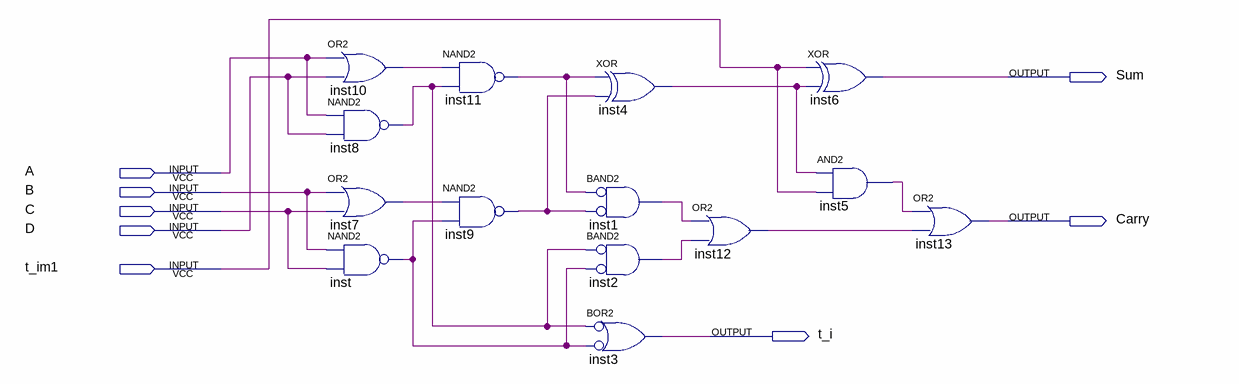
[diagram p0: schematic sheet]
// Quartus schematic 4to2_comp.bdf as structural Verilog: 14 symbols, 8 pins
module \4to2_comp  (
  input  A,
  input  B,
  input  C,
  input  D,
  input  t_im1,
  output Sum,
  output Carry,
  output t_i
);

  wire inst1_out, inst2_out, inst4_out, inst5_out, inst7_out, inst8_out, inst9_out, inst10_out, inst11_out,
       inst12_out, inst_out;

  or inst10 (inst10_out, A, D);
  nand inst8 (inst8_out, A, D);
  or inst7 (inst7_out, B, C);
  nand inst (inst_out, B, C);
  nand inst11 (inst11_out, inst10_out, inst8_out);
  nand inst9 (inst9_out, inst7_out, inst_out);
  xor inst4 (inst4_out, inst11_out, inst9_out);
  and inst1 (inst1_out, ~inst11_out, ~inst9_out);  // BAND2
  and inst2 (inst2_out, ~inst8_out, ~inst_out);  // BAND2
  or inst3 (t_i, ~inst8_out, ~inst_out);  // BOR2
  or inst12 (inst12_out, inst1_out, inst2_out);
  xor inst6 (Sum, t_im1, inst4_out);
  and inst5 (inst5_out, inst4_out, t_im1);
  or inst13 (Carry, inst5_out, inst12_out);
endmodule
